# EAGLE design Micro-Interactions (EAGLE 6.4)
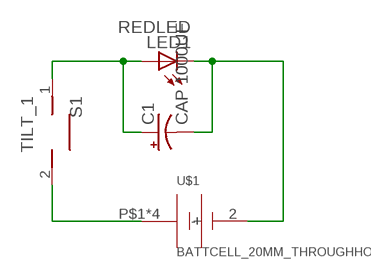
[diagram p0: schematic, sheet 1]

## Parts
C1  CAP 1000UF  CAP_POLPTH4  [CPOL-RADIAL-1000UF-25V]
LED1  REDLED  LED5MM  [LED5MM]
S1  TILT_1  DS01  [DS-01]
U$1  BATTCELL_20MM_THROUGHHOLE  [BATTCON_20MM_4LEGS]

## Nets
N$2: C1.1(+) LED1.A S1.1
N$3: C1.2(-) LED1.K(C) U$1.2(-)
N$4: S1.2 U$1.P$1(+) U$1.P$2(+) U$1.P$3(+) U$1.P$4(+)

## Library data of the parts
C1 = SparkFun-Passives:CAP_POL: Capacitor Polarized These are standard SMD and PTH capacitors. Normally 10uF, 47uF, and 100uF in electrolytic and tantalum varieties. Always verify the external diameter of the through hole cap, it varies with capacity, voltage, and manufacturer. The EIA devices should be standard.
LED1 = SparkFun-LED:LED: LEDs Standard schematic elements and footprints for 5mm, 3mm, 1206, and 0603 sized LEDs. 5mm - Spark Fun Electronics SKU : COM-00529 (and others)
S1 = switch-dil:DS01: DIL/CODE SWITCH; OC_FARNELL: unknown; OC_NEWARK: unknown
U$1 = 20mm_cell_throughholl:BATTCELL_20MM_THROUGHHOLE

## Board
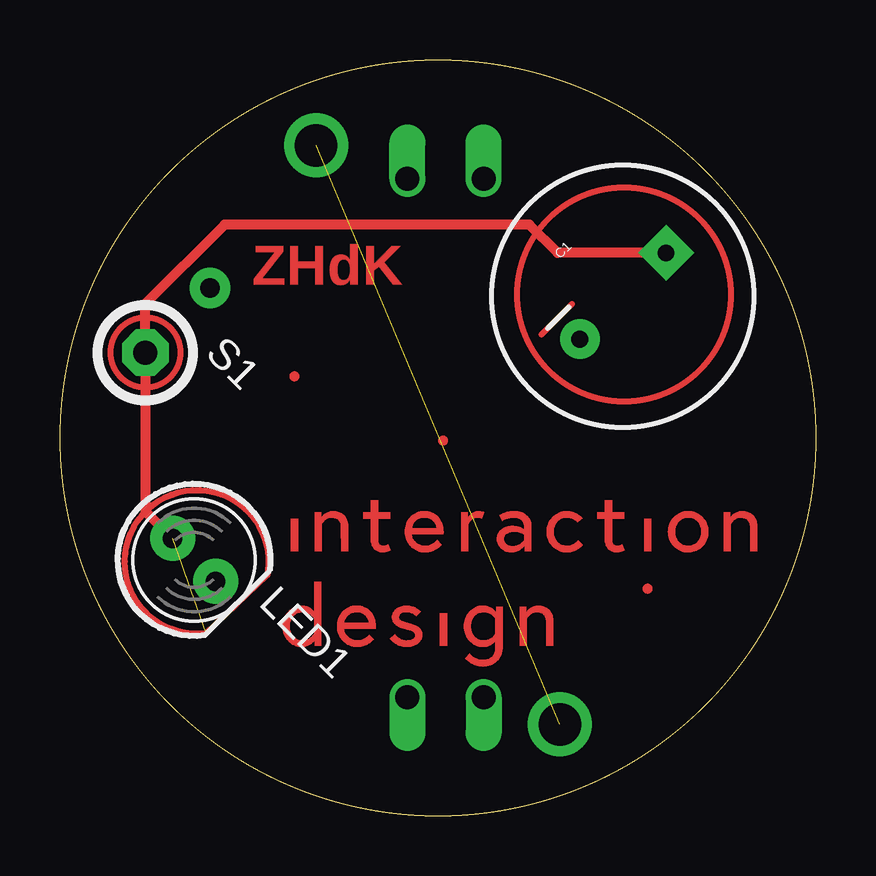
[diagram p1: board, top side]
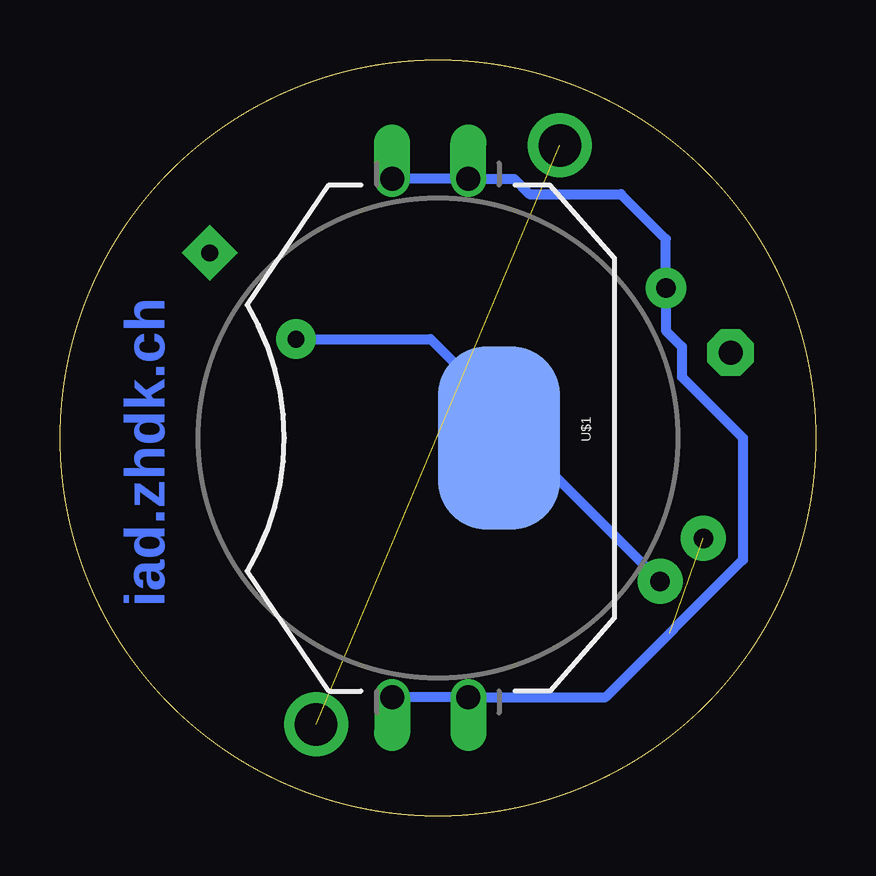
[diagram p2: board, bottom side, seen from below]

Size 31.5 x 31.5 mm. Coordinates in mm from the lower left corner, seen from the top.
Outline: circle at 15.75,15.75 radius 15.75
Copper layers (1*16): Top 0.035mm / dielectric 1.5mm / Bottom 0.035mm
Design rules "default": minimum track width 10mil, minimum drill 24mil, track to track 8mil, track to pad 8mil, pad to pad 8mil, via to via 8mil, smd to smd 8mil, copper to edge 40mil, drill to drill 8mil, minimum pad ring 10mil, minimum via ring 8mil, stop-mask expansion 4mil, vias tented up to drill 0mil, thermal gap 10mil

### Footprints (pad centres in the part's own frame; a part is rotated, then mirrored left to right if it is on the bottom)
CPOL-RADIAL-1000UF-25V = drill 0.7 pad 1.651 square: 1 2.54,0 | drill 0.7 pad 1.651: 2 -2.54,0
LED5MM = drill 0.813 pad 1.88: A -1.27,0; K 1.27,0
DS-01 = drill 1 pad 1.93 octagon: 1 0,0 | drill 0.813 pad 1.676: 2 0,3.81
BATTCON_20MM_4LEGS = smd 7.62 x 5.08: 2 0,2.54 | drill 1 offset: P$1 -10.795,1.27; P$2 -10.795,-1.905; P$3 10.795,1.27; P$4 10.795,-1.905

### Placement (x,y rotation side)
C1  23.46,21.66 45 top
LED1  5.59,10.67 315 top
S1  3.56,19.3 315 top
U$1  15.75,15.75 270 bottom
U$2  [IADLOGO_20MM]  7.37,5.46 0 top

### Tracks (layer width: path | path; a pad name or v marks a point on that pad's centre or on a via)
N$2  (1 unrouted)
  Top 0.254: 6.1,7.62 arc-288 8.64,10.03 6.1,7.62
  Top 0.406: C1.1 20.74,23.46 19.56,24.64 6.86,24.64 3.56,21.34 S1.1 3.56,12.7 LED1.A
N$3
  Bottom 0.406: C1.2 16.06,19.87 14.48,18.29 14.48,17.02 U$1.2 12.46,15.75 LED1.K
N$4
  Bottom 0.406: U$1.P$2 U$1.P$1 12.57,26.54 11.94,25.91 8.13,25.91 6.25,24.03 S1.2 6.25,20.22 5.59,19.56 5.59,18.29 3.05,15.75 3.05,10.67 8.76,4.95 U$1.P$3 U$1.P$4
N$5
  Top 0.254: 21.34,21.34 20.07,20.07
N$10  (via drill 1.78 pad 0.03)  (1 unrouted)
  other vias: 10.67,27.94 20.83,3.81
(copper drawn outside any net)
  shapes: Top circle x2

### Text on the board
Top: ZHdK
Bottom: iad.zhdk.ch